# EAGLE schematic slaveMeteo (EAGLE 9.0.0)
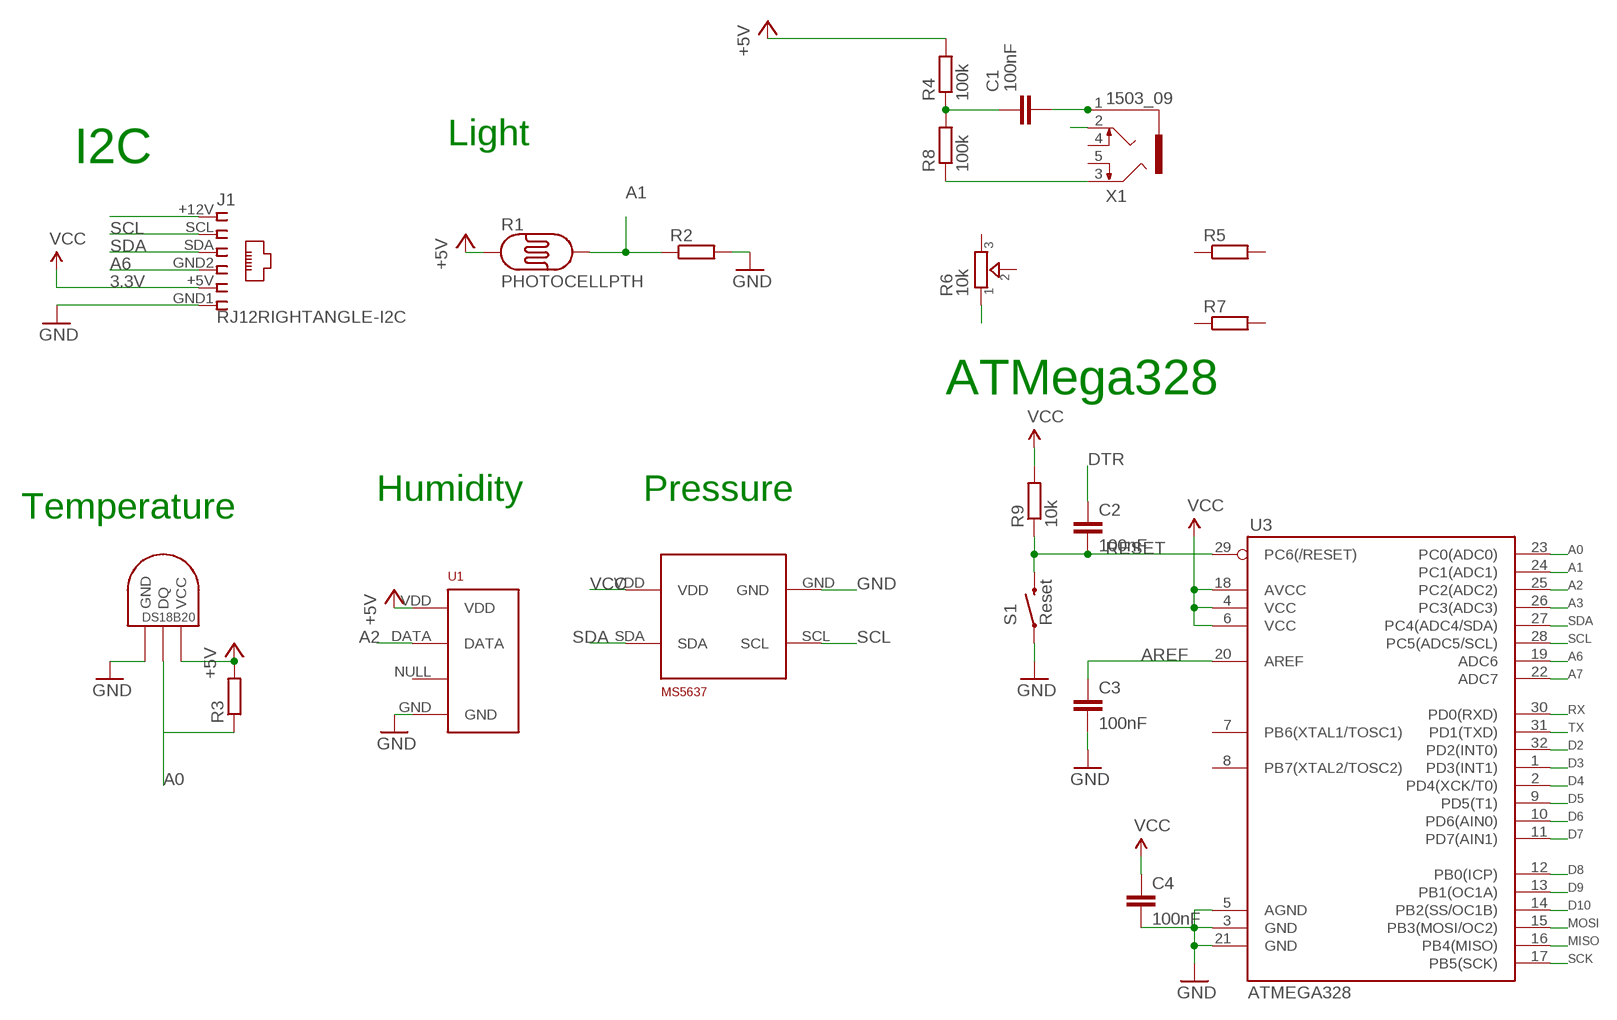
[diagram p0: schematic, sheet 1]

## Parts
C1  100nF  CAPACITOR_NPOL-0805  [C805]
C2  100nF  C-EUC0805K  [C0805K]
C3  100nF  C-EUC0805K  [C0805K]
C4  100nF  C-EUC0805K  [C0805K]
J1  RJ12RIGHTANGLE-I2C  [RJ12-RIGHTANGLE-I2C]
R1  PHOTOCELLPTH  [PHOTOCELL]
R2  R-EU_R0805  [R0805]
R3  R-EU_R0805  [R0805]
R4  100k  R-EU_R0805  [R0805]
R5  R-EU_R0805  [R0805]
R6  10k  TRIMMER-3362P  [TRIMMER_3362P]
R7  R-EU_R0805  [R0805]
R8  100k  R-EU_R0805  [R0805]
R9  10k  R-EU_R0805  [R0805]
S1  Reset  SWITCH-MOMENTARY-2SMD-ALT01  [TACTILE-SWITCH-SMD-ALT01]
U1  RHT03_DHT-22_AM2302RA  [RHT03_DHT-22/RA]
U3  ATMEGA328  ATMEGA168  [TQFP32-08]
U$1  DS1820TO92  [DS1820]
U$19  MS5637  [MS5637]
X1  1503_09  [1503_09]

## Nets
3.3V: J1.+5V ; supply symbol labelled VCC
+5V: R1.1 R3.2 R4.2 U1.VDD U$1.VDD(VCC)
A0: R3.1 U3.23(PC0(ADC0)) U$1.DQ
A1: R1.2 R2.1 U3.24(PC1(ADC1))
A2: U1.DATA U3.25(PC2(ADC2))
A3: U3.26(PC3(ADC3))
A6: J1.GND2 U3.19(ADC6)
A7: U3.22(ADC7)
AREF: C3.1 U3.20(AREF)
D2: U3.32(PD2(INT0))
D3: U3.1(PD3(INT1))
D4: U3.2(PD4(XCK/T0))
D5: U3.9(PD5(T1))
D6: U3.10(PD6(AIN0))
D7: U3.11(PD7(AIN1))
D8: U3.12(PB0(ICP))
D9: U3.13(PB1(OC1A))
D10: U3.14(PB2(SS/OC1B))
DTR: C2.1
GND [power]: C3.2 C4.2 J1.GND1 R2.2 S1.1 S1.2 U1.GND U3.3(GND) U3.5(AGND) U3.21(GND) U$1.GND U$19.GND
GND1 [power]: R6.1
GND2 [power]: R8.1 X1.3
MISO: U3.16(PB4(MISO))
MOSI: U3.15(PB3(MOSI/OC2))
N$4: J1.+12V
N$5: C1.1 R4.1 R8.2
N$14 [power]: C1.2 X1.1
N$21 [power]: X1.2
RESET: C2.2 R9.1 S1.3 S1.4 U3.29(PC6(/RESET))
RX: U3.30(PD0(RXD))
SCK: U3.17(PB5(SCK))
SCL: J1.SCL U3.28(PC5(ADC5/SCL)) U$19.SCL
SDA: J1.SDA U3.27(PC4(ADC4/SDA)) U$19.SDA
TX: U3.31(PD1(TXD))
VCC: C4.1 R9.2 U3.4(VCC) U3.6(VCC) U3.18(AVCC) U$19.VDD
Unconnected: R5.1 R5.2 R6.2 R6.3 R7.1 R7.2 U1.NULL U3.7(PB6(XTAL1/TOSC1)) U3.8(PB7(XTAL2/TOSC2)) X1.4 X1.5

## Notes on the sheet
- Light
- I2C
- ATMega328
- Humidity | Pressure
- Temperature

## Library data of the parts
C1 = dp_devices:CAPACITOR_NPOL: Non-Polarized capacitor in various packages
C2-C4 = rcl:C-EU: CAPACITOR, European symbol; ELECROW: C49678; LCSC: C49678; MPN: 80-C1206C104K5R
J1 = lpatiny:RJ12: CORCOM Modular RJ Jacks No Shield Source: www.tycoelectronics.com .. ENG_DS_1654001_1099_RJ_L_0507.pdf
R1 = SparkFun:PHOTOCELL: Photocell Also known as a CdS photoresistor. This is a low cost way to detect light levels. Resistance decreases with more incoming light. SparkFun SKU: SEN-09088
R2-R5 R7 R8 = resistor:R-EU_: RESISTOR, European symbol
R6 = dp_devices:TRIMMER: Trimmer resistor
R9 = rcl:R-EU_: RESISTOR, European symbol; ELECROW: C17513; LCSC: C17513
S1 = Testing:SWITCH-MOMENTARY-2: Various NO switches- pushbuttons, reed, etc
U1 = RHT03_DHT-22_AM2302:RHT03_DHT-22_AM2302: RHT03 / DHT-22 / AM2302 Packages and symbol for the RHT03 / DHT-22 relative humidity and temperature sensor. Note: The AM2302 is a wired version of the DHT-22 which typically requires less clearance and is thus provided as a separate package.; PROD_ID: SEN-10167
U3 = SparkFun:ATMEGA168
U$1 = Ava:DS1820: DS18B20 Programmable Resolution 1-Wire Digital Thermometer Description The DS18B20 digital thermometer provides 9-bit to 12-bit Celsius temperature measurements and has an alarm function with nonvolatile user-programmable upper and lower trigger points. The DS18B20 communicates over a 1-Wire® bus that by definition requires only one data line (and ground) for communication with a central microprocessor. It has an operating temperature range of -55°C to +125°C and is accurate to ±0.5°C over the range of -10°C to +85°C. In addition, the DS18B20 can derive power directly from the data line ("parasite power"), eliminating the need for an external power supply. Each DS18B20 has a unique 64-bit serial code, which allows multiple DS18B20s to function on the same 1-Wire bus. Thus, it is simple to use one microprocessor to control many DS18B20s distributed over a large area. Applications that can benefit from this feature include HVAC environmental controls, temperature monitoring systems inside buildings, equipment, or machinery, and process monitoring and control systems.
U$19 = MS5637:MS5637: Le MS563702BA03-50 est un Micro Altimètre ultra compact optimisé pour des applications d'altimètre et de baromètre dans des téléphones portables et des tablettes. La résolution d'altitude au niveau de la mer est de 13cm d'air. Le module de capteur comprend un capteur de pression haute linéarité et un CAN ΔΣ 24 bits ultra faible puissance avec des coefficients internes calibrés en usine. Il fournit une valeur numérique de pression et de température précise de 24 bits et différents modes de fonctionnement qui permettent à l'utilisateur d'optimiser la vitesse de conversion et la consommation de courant. La sortie de température à haute résolution permet la mise en œuvre d'une fonction altimètre / thermomètre sans capteur supplémentaire. Il peut être interfacé avec pratiquement tous les microcontrôleurs à interface I²C-bus. Le protocole de communication est simple, sans avoir à programmer des registres internes dans l'appareil. Faibles dimensions de 3 x 3 x 0.9mm³ pour une intégratio Module haute résolution, 13cm Capteur de pression numérique intégré (CAN ΔΣ 24 bits) Interface I²C Plage de pression étendue de 10 à 2000mbar Conversion rapide jusqu'à 0.5ms Faible consommation, 0.6µA (veille <=0.1µA à 25°C) Aucun composant externe (oscillateur interne)
X1 = con-lumberg:1503_09: Jack connectors according to JISC 6560, 3.5 mm Klinkeneinbaukupplung nach JISC 6560, 3,5 mm, 3-polig/ stereo, abgewinkelte Ausführung, mit 2 Öffnern und Lötaugen, für Leiterplatten Rückseitenmontage Source: http://www.lumberg.com/Produkte/PDFs/1503_09.pdf; OC_FARNELL: 1243244; OC_NEWARK: unknown

## Net classes
0 default: width 0.406 mm, clearance 0.25 mm
1 power: width 0.406 mm, drill 0.305 mm, clearance 0.25 mm